# Altium schematic sheet Main.SchDoc
size A
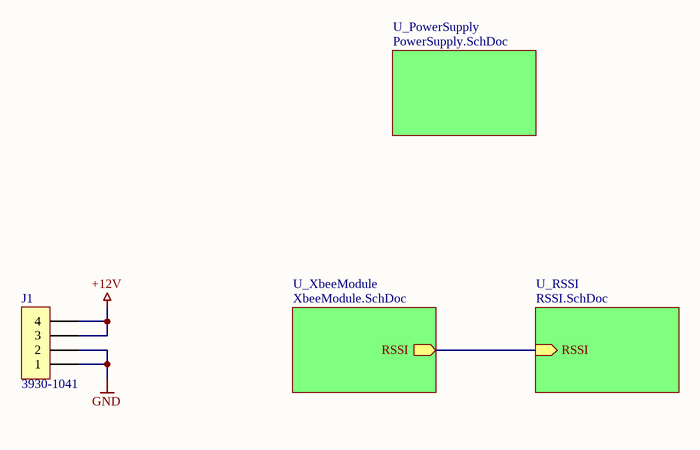
[diagram p0: Main.SchDoc]

## Parts
J1  3930-1041  [MOLEX-3930-1041]

## Sub-sheets
U_PowerSupply = PowerSupply.SchDoc: no entries
U_RSSI = RSSI.SchDoc: RSSI (in)
U_XbeeModule = XbeeModule.SchDoc: RSSI (out)

## Nets
+12V: J1.3 J1.4
GND: J1.1 J1.2
(unnamed): sheet U_RSSI/RSSI, sheet U_XbeeModule/RSSI

## Library data of the parts
J1 = Molex-MiniFit-4-RA: Molex MiniFit, Dual Row, Right Angle 3930-1041; Supplier 1: Mouser; Supplier Part Number 1: 538-39-30-1041